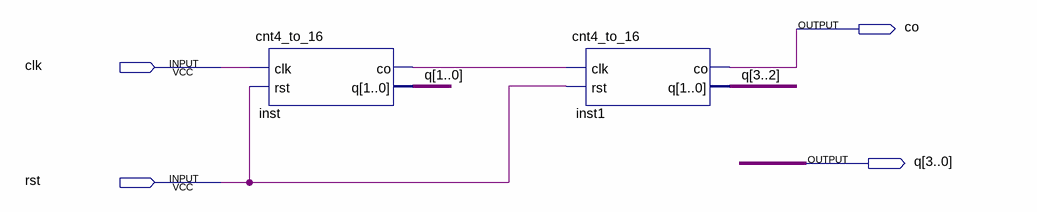
[diagram p0: schematic sheet]
// Quartus schematic Block1.bdf as structural Verilog: 2 symbols, 4 pins
module Block1 (
  input  clk,
  input  rst,
  output co,
  output [3:0] q
);

  wire inst_co;

  cnt4_to_16 inst (.clk(clk), .rst(rst), .co(inst_co), .q(q[1:0]));
  cnt4_to_16 inst1 (.clk(inst_co), .rst(rst), .co(co), .q(q[3:2]));
endmodule
